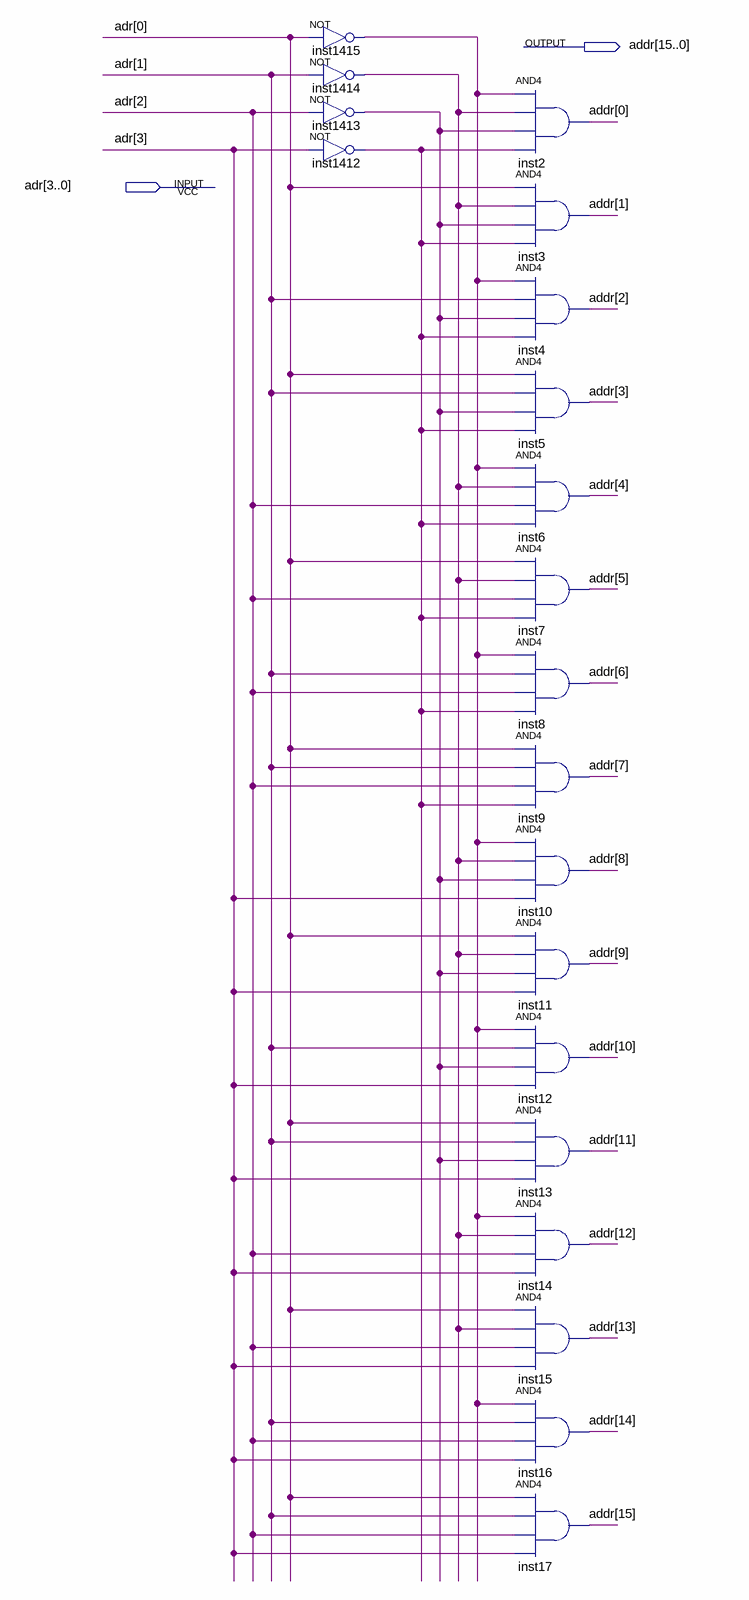
[diagram p0: schematic sheet]
// Quartus schematic ymq_4.bdf as structural Verilog: 20 symbols, 2 pins
module ymq_4 (
  input  [3:0] adr,
  output [15:0] addr
);

  wire inst1412_out, inst1413_out, inst1414_out, inst1415_out;

  not inst1415 (inst1415_out, adr[0]);
  not inst1414 (inst1414_out, adr[1]);
  not inst1413 (inst1413_out, adr[2]);
  not inst1412 (inst1412_out, adr[3]);
  and inst2 (addr[0], inst1415_out, inst1414_out, inst1413_out, inst1412_out);
  and inst3 (addr[1], adr[0], inst1414_out, inst1413_out, inst1412_out);
  and inst4 (addr[2], inst1415_out, adr[1], inst1413_out, inst1412_out);
  and inst5 (addr[3], adr[0], adr[1], inst1413_out, inst1412_out);
  and inst6 (addr[4], inst1415_out, inst1414_out, adr[2], inst1412_out);
  and inst7 (addr[5], adr[0], inst1414_out, adr[2], inst1412_out);
  and inst8 (addr[6], inst1415_out, adr[1], adr[2], inst1412_out);
  and inst9 (addr[7], adr[0], adr[1], adr[2], inst1412_out);
  and inst10 (addr[8], inst1415_out, inst1414_out, inst1413_out, adr[3]);
  and inst11 (addr[9], adr[0], inst1414_out, inst1413_out, adr[3]);
  and inst12 (addr[10], inst1415_out, adr[1], inst1413_out, adr[3]);
  and inst13 (addr[11], adr[0], adr[1], inst1413_out, adr[3]);
  and inst14 (addr[12], inst1415_out, inst1414_out, adr[2], adr[3]);
  and inst15 (addr[13], adr[0], inst1414_out, adr[2], adr[3]);
  and inst16 (addr[14], inst1415_out, adr[1], adr[2], adr[3]);
  and inst17 (addr[15], adr[0], adr[1], adr[2], adr[3]);
endmodule
